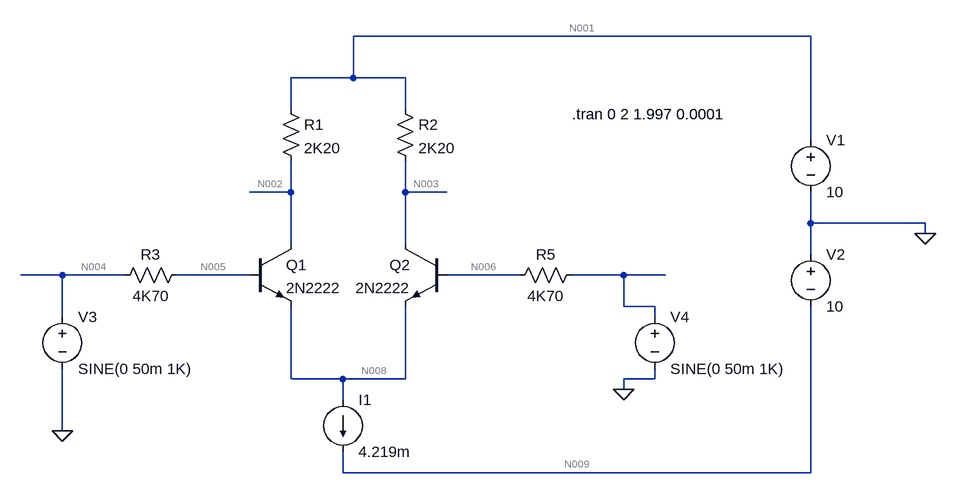
[diagram p0: schematic circuit.asc]
circuit.asc, the LTspice schematic file:
Version 4
SHEET 1 1124 680
WIRE 928 -208 224 -208
WIRE 224 -144 224 -208
WIRE 224 -144 128 -144
WIRE 304 -144 224 -144
WIRE 128 -96 128 -144
WIRE 304 -96 304 -144
WIRE 928 -48 928 -208
WIRE 128 32 128 -16
WIRE 128 32 64 32
WIRE 304 32 304 -16
WIRE 368 32 304 32
WIRE 928 80 928 32
WIRE 1104 80 928 80
WIRE 1104 96 1104 80
WIRE 128 112 128 32
WIRE 304 112 304 32
WIRE 928 128 928 80
WIRE -224 160 -288 160
WIRE -128 160 -224 160
WIRE 64 160 -48 160
WIRE 480 160 368 160
WIRE 640 160 560 160
WIRE 704 160 640 160
WIRE 640 208 640 160
WIRE 688 208 640 208
WIRE -224 224 -224 160
WIRE 688 224 688 208
WIRE 128 320 128 208
WIRE 208 320 128 320
WIRE 304 320 304 208
WIRE 304 320 208 320
WIRE 688 320 688 304
WIRE 688 320 640 320
WIRE 640 336 640 320
WIRE 208 352 208 320
WIRE -224 400 -224 304
WIRE 208 464 208 432
WIRE 928 464 928 208
WIRE 928 464 208 464
FLAG 1104 96 0
FLAG 640 336 0
FLAG -224 400 0
SYMBOL npn 64 112 R0
SYMATTR InstName Q1
SYMATTR Value 2N2222
SYMBOL npn 368 112 M0
SYMATTR InstName Q2
SYMATTR Value 2N2222
SYMBOL res 112 -112 R0
SYMATTR InstName R1
SYMATTR Value 2K20
SYMBOL res 288 -112 R0
SYMATTR InstName R2
SYMATTR Value 2K20
SYMBOL res -32 144 R90
WINDOW 0 0 56 VBottom 2
WINDOW 3 32 56 VTop 2
SYMATTR InstName R3
SYMATTR Value 4K70
SYMBOL res 576 144 R90
WINDOW 0 0 56 VBottom 2
WINDOW 3 32 56 VTop 2
SYMATTR InstName R5
SYMATTR Value 4K70
SYMBOL voltage 928 -64 R0
WINDOW 123 0 0 Left 0
WINDOW 39 0 0 Left 0
SYMATTR InstName V1
SYMATTR Value 10
SYMBOL voltage 928 112 R0
WINDOW 123 0 0 Left 0
WINDOW 39 0 0 Left 0
SYMATTR InstName V2
SYMATTR Value 10
SYMBOL voltage -224 208 R0
WINDOW 123 0 0 Left 0
WINDOW 39 0 0 Left 0
SYMATTR InstName V3
SYMATTR Value SINE(0 50m 1K)
SYMBOL current 208 352 R0
WINDOW 123 0 0 Left 0
WINDOW 39 0 0 Left 0
SYMATTR InstName I1
SYMATTR Value 4.219m
SYMBOL voltage 688 208 R0
WINDOW 123 0 0 Left 0
WINDOW 39 0 0 Left 0
SYMATTR InstName V4
SYMATTR Value SINE(0 50m 1K)
TEXT 560 -88 Left 2 !.tran 0 2 1.997 0.0001

The netlist it stands for:
* circuit.asc
Q1 N002 N005 N008 0 2N2222
Q2 N003 N006 N008 0 2N2222
R1 N001 N002 2K20
R2 N001 N003 2K20
R3 N005 N004 4K70
R5 N007 N006 4K70
V1 N001 0 10
V2 0 N009 10
V3 N004 0 SINE(0 50m 1K)
I1 N008 N009 4.219m
V4 N007 0 SINE(0 50m 1K)
.model NPN NPN
.model PNP PNP
.lib standard.bjt
.tran 0 2 1.997 0.0001
.backanno
.end

* Results of the author's LTspice run, read from the files saved beside the schematic
* Operating Point, zero values left out:
*   V(n002) = 5.381 V
*   V(n005) = -47.11 mV
*   V(n008) = -720.7 mV
*   V(n003) = 5.381 V
*   V(n006) = -47.11 mV
*   V(n001) = 10 V
*   V(n009) = -10 V
*   Ic(Q1) = 2.099 mA
*   Ib(Q1) = 10.02 µA
*   Ie(Q1) = -2.11 mA
*   Ic(Q2) = 2.099 mA
*   Ib(Q2) = 10.02 µA
*   Ie(Q2) = -2.11 mA
*   I(I1) = 4.219 mA
*   I(R1) = 2.099 mA
*   I(R2) = 2.099 mA
*   I(R3) = -10.02 µA
*   I(R5) = 10.02 µA
*   I(V1) = -4.199 mA
*   I(V2) = -4.219 mA
*   I(V3) = -10.02 µA
*   I(V4) = -10.02 µA
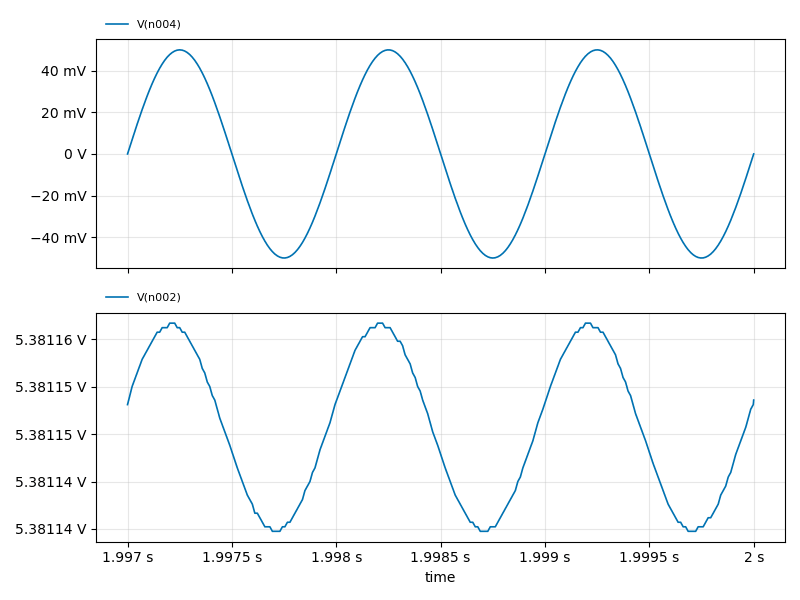
[diagram p1: Transient Analysis of circuit.asc, plotted from the saved traces]
* Transient Analysis, 1 run:
*   V(n004): min -50 mV, max 50 mV, average 1.407 µV, rms 35.39 mV, last 0 V
*   V(n002): min 5.381 V, max 5.381 V, average 5.381 V, rms 5.381 V, last 5.381 V